# EAGLE schematic AnimalClicker (EAGLE 9.6.0)
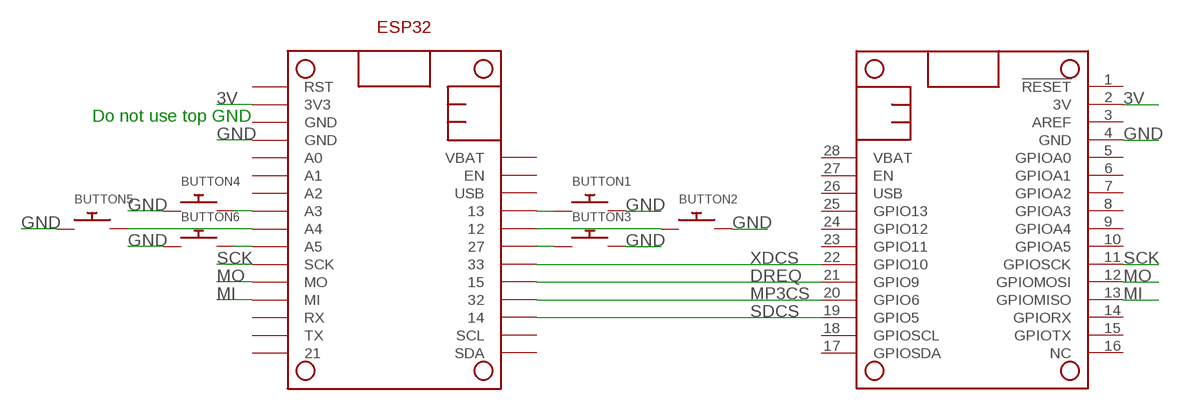
[diagram p0: schematic, sheet 1]

## Parts
BUTTON1  SWITCH_PUSHBUTTONSOFTTOUCHSMD_SJ  [PUSHBUTTON_SMD_SJ]
BUTTON2  SWITCH_PUSHBUTTONSOFTTOUCHSMD_SJ  [PUSHBUTTON_SMD_SJ]
BUTTON3  SWITCH_PUSHBUTTONSOFTTOUCHSMD_SJ  [PUSHBUTTON_SMD_SJ]
BUTTON4  SWITCH_PUSHBUTTONSOFTTOUCHSMD_SJ  [PUSHBUTTON_SMD_SJ]
BUTTON5  SWITCH_PUSHBUTTONSOFTTOUCHSMD_SJ  [PUSHBUTTON_SMD_SJ]
BUTTON6  SWITCH_PUSHBUTTONSOFTTOUCHSMD_SJ  [PUSHBUTTON_SMD_SJ]
ESP32  RARNDT-MISCELANEOUS_FEATHERBOARD_ESP32FETHERWING_DIM_ESP32  [RARNDT-MISCELANEOUS_FEATHERBOARD_ESP32]
VS1053  FEATHERWING  [FEATHERWING]

## Nets
3V: ESP32.2(3V3) VS1053.2(3V)
BUTTON3: BUTTON2.P$1 ESP32.24
DREQ: ESP32.21 VS1053.21(GPIO9)
GND: BUTTON1.P$2 BUTTON2.P$2 BUTTON3.P$2 BUTTON4.P$1 BUTTON5.P$1 BUTTON6.P$1 ESP32.4(GND) VS1053.4(GND)
MI: ESP32.13(MI) VS1053.13(GPIOMISO)
MO: ESP32.12(MO) VS1053.12(GPIOMOSI)
MP3CS: ESP32.20 VS1053.20(GPIO6)
N$1: BUTTON1.P$1 ESP32.25
N$2: BUTTON6.P$2 ESP32.10(A5)
N$3: BUTTON5.P$2 ESP32.9(A4)
N$4: BUTTON3.P$1 ESP32.23
N$5: BUTTON4.P$2 ESP32.8(A3)
SCK: ESP32.11(SCK) VS1053.11(GPIOSCK)
SDCS: ESP32.19 VS1053.19(GPIO5)
XDCS: ESP32.22 VS1053.22(GPIO10)
Unconnected: ESP32.1(RST) ESP32.3(GND) ESP32.5(A0) ESP32.6(A1) ESP32.7(A2) ESP32.14(RX) ESP32.15(TX) ESP32.16 ESP32.17(SDA) ESP32.18(SCL) ESP32.26(USB) ESP32.27(EN) ESP32.28(VBAT) VS1053.1(!RESET) VS1053.3(AREF) VS1053.5(GPIOA0) VS1053.6(GPIOA1) VS1053.7(GPIOA2) VS1053.8(GPIOA3) VS1053.9(GPIOA4) VS1053.10(GPIOA5) VS1053.14(GPIORX) VS1053.15(GPIOTX) VS1053.16(NC) VS1053.17(GPIOSDA) VS1053.18(GPIOSCL) VS1053.23(GPIO11) VS1053.24(GPIO12) VS1053.25(GPIO13) VS1053.26(USB) VS1053.27(EN) VS1053.28(VBAT)

## Notes on the sheet
- Do not use top GND

## Library data of the parts
BUTTON1-BUTTON6 = adafruit:SWITCH_PUSHBUTTON: Buttons SOFTTOUCHSMD_SJ - Soft touch temporary push button (Super Junk Akihabara) Compatible with SKPMANE010 [Mouser: 688-SKPMAN] C&K_KSS = Digikey: KSS221GLFS
ESP32 = StewartPlatform:RARNDT-MISCELANEOUS_FEATHERBOARD_ESP32
VS1053 = adafruit:FEATHERWING